# Altium schematic sheet LIGHT-TDS.SchDoc
size A3; Revision: 10
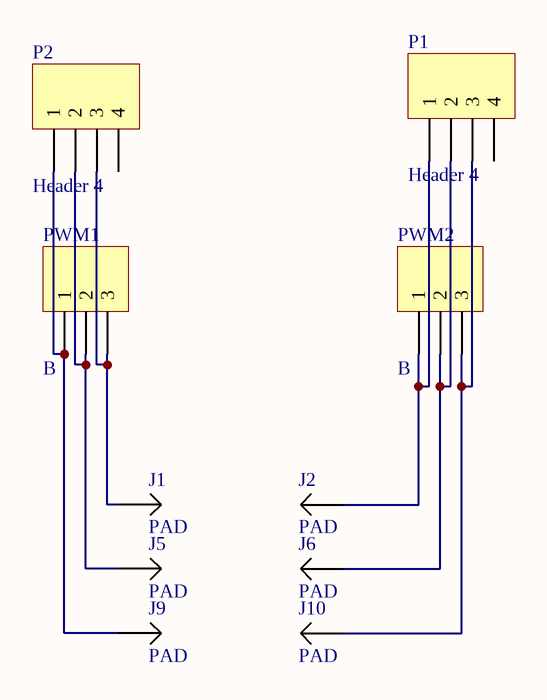
[diagram p0: LIGHT-TDS.SchDoc]

## Parts
J1  PAD  [PAD]
J2  PAD  [PAD]
J5  PAD  [PAD]
J6  PAD  [PAD]
J9  PAD  [PAD]
J10  PAD  [PAD]
P1  Header 4  [HDR1X4]
P2  Header 4  [HDR1X4]
PWM1  B  [HDR Side 3 pin]
PWM2  B  [HDR Side 3 pin]

## Nets
NetJ1_1: J1.1 P2.3 PWM1.3
NetJ2_1: J2.1 P1.1 PWM2.1
NetJ5_1: J5.1 P2.2 PWM1.2
NetJ6_1: J6.1 P1.2 PWM2.2
NetJ9_1: J9.1 P2.1 PWM1.1
NetJ10_1: J10.1 P1.3 PWM2.3

Not connected (* = marked no-connect by the designer): P1 4; P2 4

## Library data of the parts
J1 J2 J5 J6 J9 J10 = PAD: Header 1; System: Connector; MF: Connfly electronic (Zhenqin); MP: PLS-3 (DS1021-1x3); Type: SMD; ChipDip_Link: https://www.chipdip.ru/product/pls-3; HelpURL: https://static.chipdip.ru/lib/227/DOC000227157.pdf
P1 P2 = Header 4: Header, 4-Pin
PWM1 PWM2 = Header 3: Header, 3-Pin; Instructions: plased to the side; see picture; System: Connector; MF: Connfly electronic (Zhenqin); MP: PLS-3 (DS1021-1x3); Type: SMD; ChipDip_Link: https://www.chipdip.ru/product/pls-3; HelpURL: https://static.chipdip.ru/lib/227/DOC000227157.pdf